# EasyEDA Pro project ProPrj_SX1262 125CM v0.5_2026-09-01.epro

# Schematic Schematic1
Board Name: Board1; Create Date: 2026-09-01; Page Name: P1; Project Name: SX1262 125CM v0.5; Schematic Name: Schematic1; Update Date: 2026-09-01; Company: EasyEDA.com; Page Size: A4; Version: V1.0
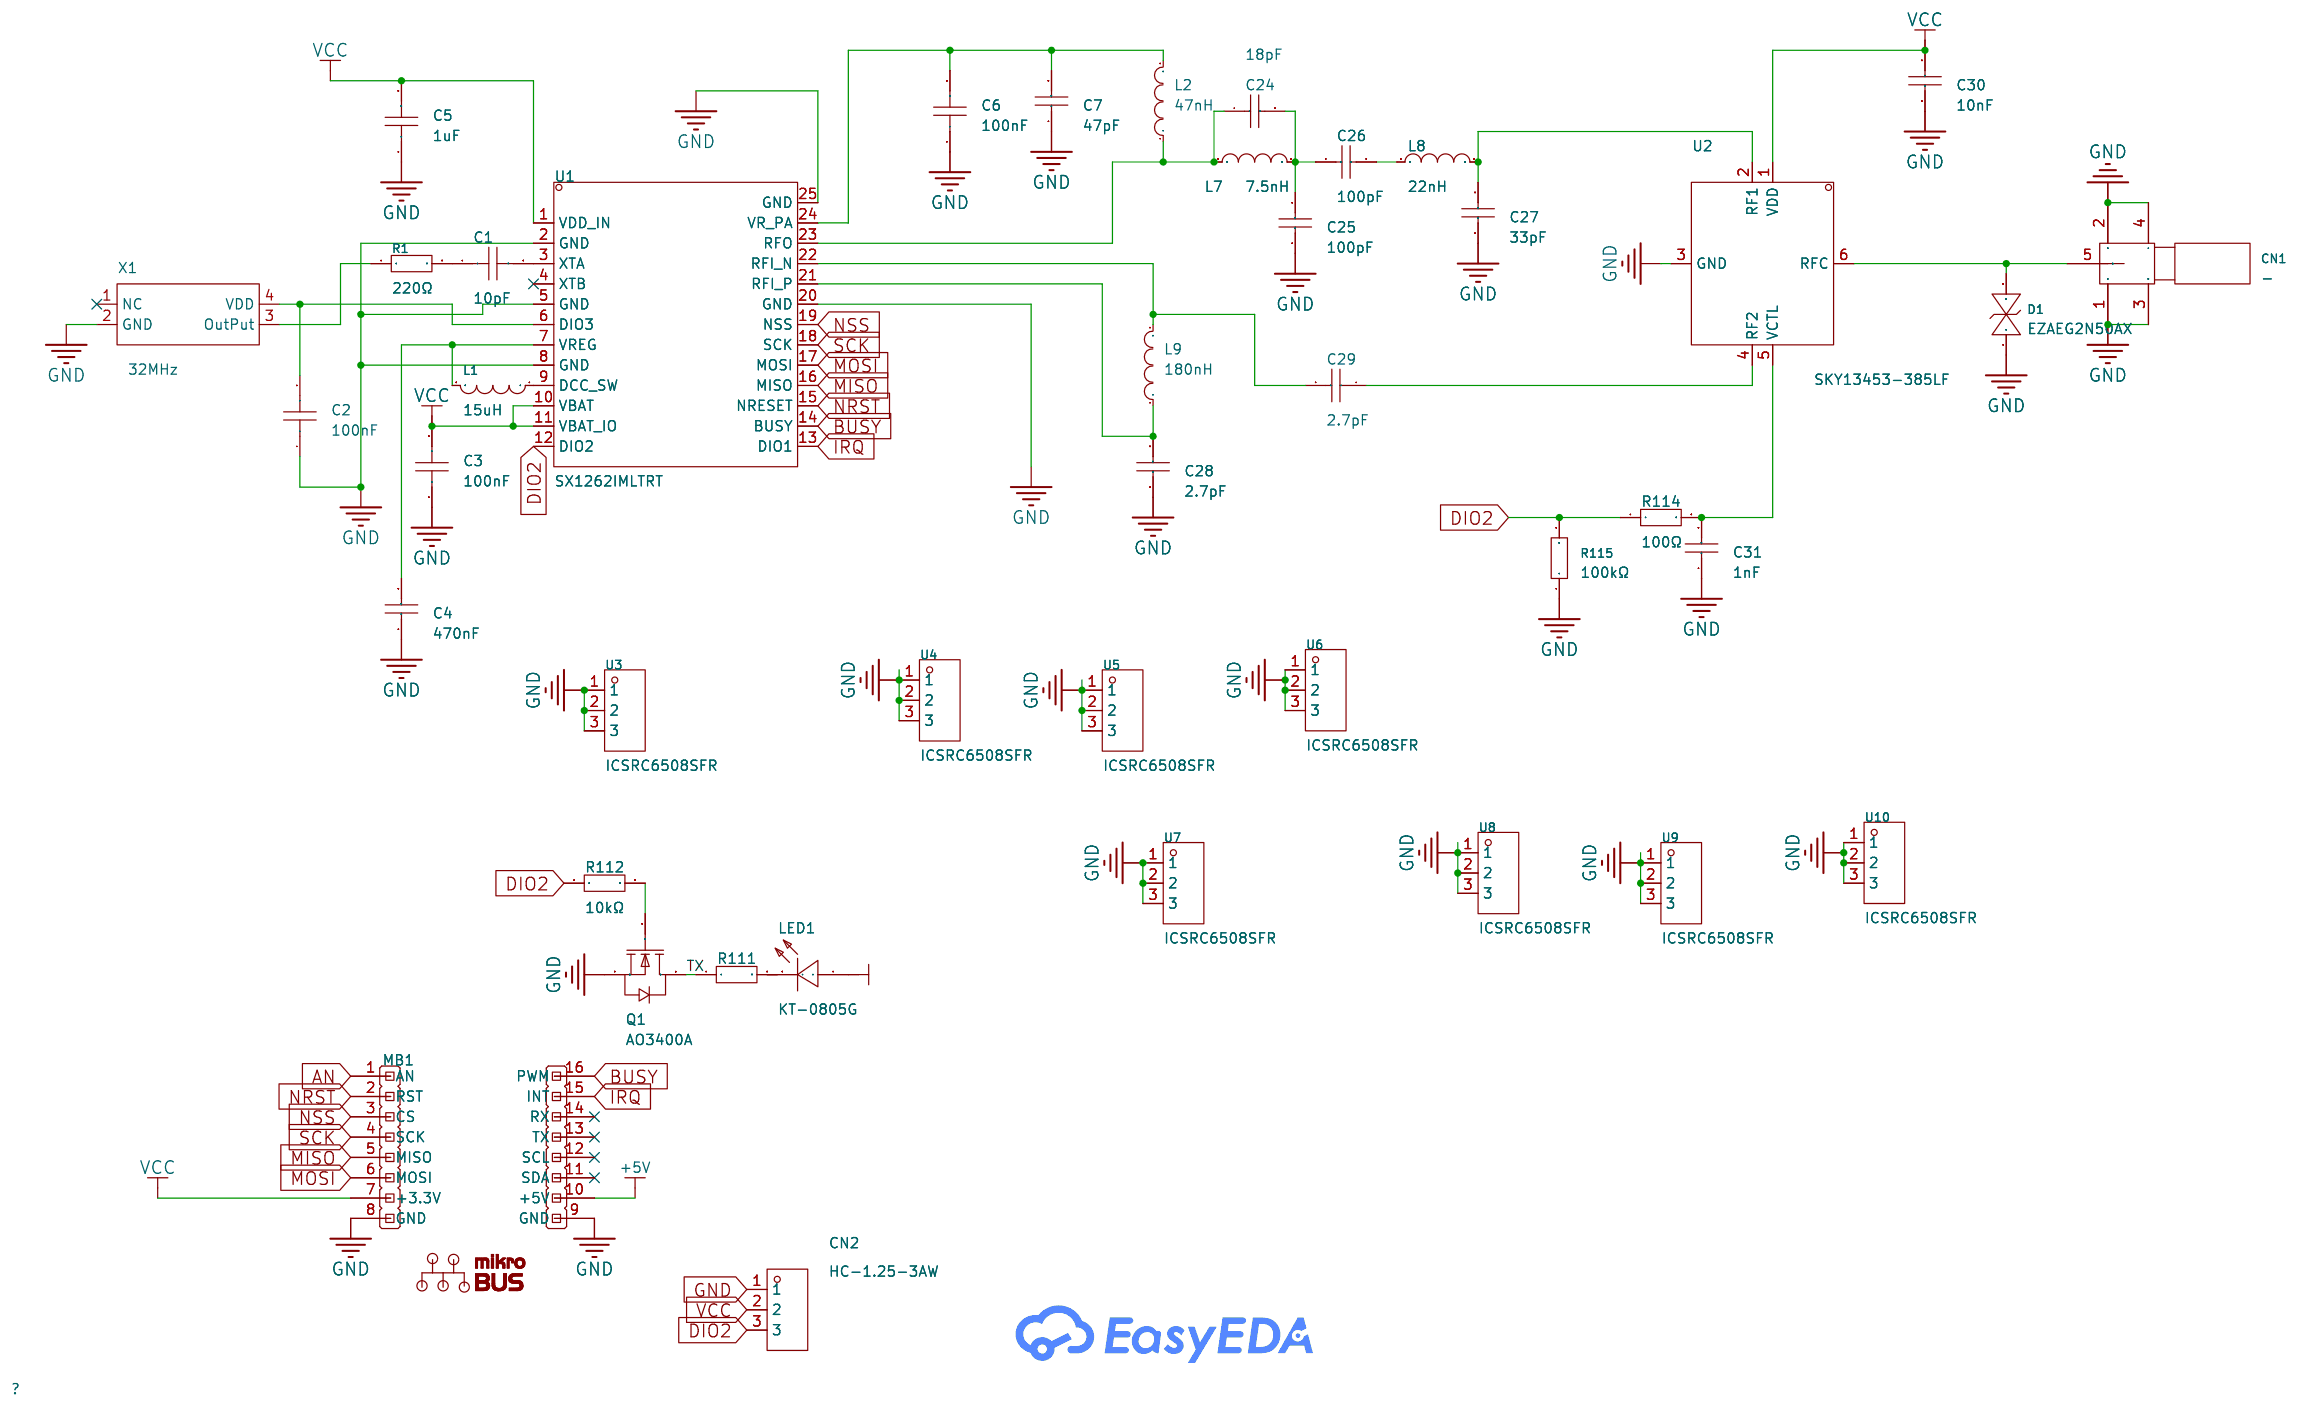
[diagram p0: schematic sheet]

## Parts
C1  10pF  [C0402]
C2  100nF  [C0402]
C3  100nF  [C0402]
C4  470nF  [C0603]
C5  1uF  [C0402]
C6  100nF  [C0402]
C7  47pF  [C0402]
C24  18pF  [C0402]
C25  100pF  [C0402]
C26  100pF  [C0402]
C27  33pF  [C0402]
C28  2.7pF  [C0402]
C29  2.7pF  [C0402]
C30  10nF  [C0402]
C31  1nF  [C0402]
CN1  -  [CONN-SMD_KH-SMA-KE8-G]
CN2  HC-1.25-3AW  [CONN-TH_3P-P1.25_HCTL_HC-1.25-3AW]
D1  EZAEG2N50AX  [D0402-BI]
L1  15uH  [L0805]
L2  47nH  [IND-SMD_L1.2-W0.6-1]
L7  7.5nH  [L0402]
L8  22nH  [L0402]
L9  180nH  [L0402-RD]
LED1  KT-0805G  [LED0805-R-RD]
MB1  -  [mikroBUS add-on Board]
Q1  AO3400A  [SOT-23-3_L2.9-W1.3-P1.90-LS2.4-BR]
R1  220Ω  [R0402]
R111  470Ω  [R0402]
R112  10kΩ  [R0402]
R114  100Ω  [R0402]
R115  100kΩ  [R0402]
U1  SX1262IMLTRT  [QFN-24_L4.0-W4.0-P0.50-BL-EP2.6]
U2  SKY13453-385LF  [QFN-6_L1.0-W1.0-P0.50-LS1.0-BL]
U3  ICSRC6508SFR  [SMD_3P-L6.7-W0.9-R3-P2.65-ICSRC6508SFR]
U4  ICSRC6508SFR  [SMD_3P-L6.7-W0.9-R3-P2.65-ICSRC6508SFR]
U5  ICSRC6508SFR  [SMD_3P-L6.7-W0.9-R3-P2.65-ICSRC6508SFR]
U6  ICSRC6508SFR  [SMD_3P-L6.7-W0.9-R3-P2.65-ICSRC6508SFR]
U7  ICSRC6508SFR  [SMD_3P-L6.7-W0.9-R3-P2.65-ICSRC6508SFR]
U8  ICSRC6508SFR  [SMD_3P-L6.7-W0.9-R3-P2.65-ICSRC6508SFR]
U9  ICSRC6508SFR  [SMD_3P-L6.7-W0.9-R3-P2.65-ICSRC6508SFR]
U10  ICSRC6508SFR  [SMD_3P-L6.7-W0.9-R3-P2.65-ICSRC6508SFR]
X1  32MHz  [OSC-SMD_4P-L2.0-W1.6-BL_1]

## Library data of the parts
C1 = CL05C100JB5NNNC: Capacitance:10pF Tolerance:±5% Tolerance:±5% Voltage Rating:50V Temperature Coefficient:C0G; LCSC Part Name: 10pF ±5% 50V; Supplier Part: C32949; Manufacturer: SAMSUNG(三星); Supplier Footprint: 0402; JLCPCB Part Class: Basic Part; Datasheet: https://item.szlcsc.com/datasheet/CL05C100JB5NNNC/33914.html; Supplier: LCSC; Tolerance: ±5%; Voltage Rating: 50V; Temperature Coefficient: C0G
C2 C3 C6 = CL05B104KO5NNNC: Capacitance:100nF Tolerance:±10% Tolerance:±10% Voltage Rating:16V Temperature Coefficient:X7R; LCSC Part Name: 100nF ±10% 16V; Supplier Part: C1525; Manufacturer: SAMSUNG(三星); Supplier Footprint: 0402; JLCPCB Part Class: Basic Part; Datasheet: https://item.szlcsc.com/datasheet/CL05B104KO5NNNC/1877.html; Supplier: LCSC; Tolerance: ±10%; Voltage Rating: 16V; Temperature Coefficient: X7R
C4 = CL10B474KA8NNNC: Capacitance:470nF Tolerance:±10% Tolerance:±10% Voltage Rating:25V Temperature Coefficient:X7R; LCSC Part Name: 470nF ±10% 25V; Supplier Part: C1623; Manufacturer: SAMSUNG(三星); Supplier Footprint: 0603; JLCPCB Part Class: Basic Part; Datasheet: https://item.szlcsc.com/datasheet/CL10B474KA8NNNC/1975.html; Supplier: LCSC; Tolerance: ±10%; Voltage Rating: 25V; Temperature Coefficient: X7R
C5 = CL05A105KA5NQNC: Capacitance:1uF Tolerance:±10% Tolerance:±10% Voltage Rating:25V Temperature Coefficient:X5R; LCSC Part Name: 1uF ±10% 25V; Supplier Part: C52923; Manufacturer: SAMSUNG(三星); Supplier Footprint: 0402; JLCPCB Part Class: Basic Part; Datasheet: https://item.szlcsc.com/datasheet/CL05A105KA5NQNC/53938.html; Supplier: LCSC; Tolerance: ±10%; Voltage Rating: 25V; Temperature Coefficient: X5R
C7 = 0402CG470J500NT: Capacitance:47pF Tolerance:±5% Tolerance:±5% Voltage Rating:50V Temperature Coefficient:C0G; LCSC Part Name: 47pF ±5% 50V; Supplier Part: C1567; Manufacturer: FH(风华); Supplier Footprint: 0402; JLCPCB Part Class: Basic Part; Datasheet: https://item.szlcsc.com/datasheet/0402CG470J500NT/1919.html; Supplier: LCSC; Tolerance: ±5%; Voltage Rating: 50V; Temperature Coefficient: C0G
C24 = 0402CG180J500NT: Capacitance:18pF Tolerance:±5% Tolerance:±5% Voltage Rating:50V Temperature Coefficient:C0G; LCSC Part Name: 18pF ±5% 50V; Supplier Part: C1549; Manufacturer: FH(风华); Supplier Footprint: 0402; JLCPCB Part Class: Basic Part; Datasheet: https://item.szlcsc.com/datasheet/0402CG180J500NT/1901.html; Supplier: LCSC; Tolerance: ±5%; Voltage Rating: 50V; Temperature Coefficient: C0G
C25 C26 = 0402CG101J500NT: Capacitance:100pF Tolerance:±5% Tolerance:±5% Voltage Rating:50V Temperature Coefficient:C0G; LCSC Part Name: 100pF ±5% 50V; Supplier Part: C1546; Manufacturer: FH(风华); Supplier Footprint: 0402; JLCPCB Part Class: Basic Part; Datasheet: https://item.szlcsc.com/datasheet/0402CG101J500NT/1898.html; Supplier: LCSC; Tolerance: ±5%; Voltage Rating: 50V; Temperature Coefficient: C0G
C27 = 0402CG330J500NT: Capacitance:33pF Tolerance:±5% Tolerance:±5% Voltage Rating:50V Temperature Coefficient:C0G; LCSC Part Name: 33pF ±5% 50V; Supplier Part: C1562; Manufacturer: FH(风华); Supplier Footprint: 0402; JLCPCB Part Class: Basic Part; Datasheet: https://item.szlcsc.com/datasheet/0402CG330J500NT/1914.html; Supplier: LCSC; Tolerance: ±5%; Voltage Rating: 50V; Temperature Coefficient: C0G
C28 C29 = 0402CG2R7C500NT: Capacitance:2.7pF Voltage Rating:50V Temperature Coefficient:C0G; LCSC Part Name: ±0.25pF 2.7pF 50V; Supplier Part: C1561; Manufacturer: FH(风华); Supplier Footprint: 0402; JLCPCB Part Class: Extended Part; Datasheet: https://item.szlcsc.com/datasheet/0402CG2R7C500NT/1913.html; Supplier: LCSC; Voltage Rating: 50V; Temperature Coefficient: C0G
C30 = CL05B103KB5NNNC: Capacitance:10nF Tolerance:±10% Tolerance:±10% Voltage Rating:50V Temperature Coefficient:X7R; LCSC Part Name: 10nF ±10% 50V; Supplier Part: C15195; Manufacturer: SAMSUNG(三星); Supplier Footprint: 0402; JLCPCB Part Class: Basic Part; Datasheet: https://item.szlcsc.com/datasheet/CL05B103KB5NNNC/15869.html; Supplier: LCSC; Tolerance: ±10%; Voltage Rating: 50V; Temperature Coefficient: X7R
C31 = 0402B102K500NT: Capacitance:1nF Tolerance:±10% Tolerance:±10% Voltage Rating:50V Temperature Coefficient:X7R; LCSC Part Name: 1nF ±10% 50V; Supplier Part: C1523; Manufacturer: FH(风华); Supplier Footprint: 0402; JLCPCB Part Class: Basic Part; Datasheet: https://item.szlcsc.com/datasheet/0402B102K500NT/1875.html; Supplier: LCSC; Tolerance: ±10%; Voltage Rating: 50V; Temperature Coefficient: X7R
CN1 = KH-SMA-KE8-G: Connector Type:Board Side Interface:Inner Bore Number of Ports:1 Interface Diameter:- Interface Length/Height:8mm Frequency:- RF Series:SMA Impedance:- Style:Offset Pin Operating Temperature Range:- Operating Temperature Range:-; LCSC Part Name: 内孔 SMA 偏脚; Supplier Part: C530661; Manufacturer: kinghelm(金航标); Supplier Footprint: 插件; JLCPCB Part Class: Extended Part; Datasheet: https://item.szlcsc.com/datasheet/KH-SMA-KE8-G/550995.html; Supplier: LCSC; Connector Type: Board Side; Interface: Inner Bore; Number of Ports: 1; Interface Length/Height: 8mm; RF Series: SMA; Style: Offset Pin
CN2 = HC-1.25-3AW: Pins Structure:1x3P Pitch:1.25mm Mounting Type:Right Angle Reference Series:PicoBlade(MX 1.25) Number of Pins:3P Number of Rows:1 Number of PINs Per Row:3 Row Spacing:- Current Rating:1A Contact Material:Brass Contact Plating:Tin Operating Temperature:-25; LCSC Part Name: 1x3P 间距:1.25mm 弯插 系列:PicoBlade(MX 1.25); Supplier Part: C2845536; Manufacturer: HCTL(华灿天禄); Supplier Footprint: 弯插,P=1.25mm; JLCPCB Part Class: Extended Part; Datasheet: https://item.szlcsc.com/datasheet/HC-1.25-3AW/3039217.html; Supplier: LCSC; Pins Structure: 1x3P; Pitch: 1.25mm; Mounting Type: Right Angle; Reference Series: PicoBlade(MX 1.25); Number of Pins: 3P; Number of Rows: 1; Number of PINs Per Row: 3; Current Rating: 1A; Contact Material: Brass; Contact Plating: Tin; Operating Temperature: -25℃~+85℃; Voltage Rating: 125V; Plastic Material: PA46; Flame Retardant Rating: UL94V-0; Z-Height of the Board: 3.2mm; X-Length of Bottom Edge on Board (Spacing Line): 5.5mm; Y-Width of Bottom Edge on Board: 4.7mm
D1 = EZAEG2N50AX: Reverse Stand-Off Voltage (Vrwm):30V Clamping Voltage:100V Reverse Leakage Current (Ir):1mA Operating Temperature:-55℃~+125℃ Operating Temperature:-55℃~+125℃ level of protection:IEC 61000-4-2 Type:ESD Junction Capacitance:0.05pF; Supplier Part: C543662; Manufacturer: PANASONIC(松下); Supplier Footprint: 0402; JLCPCB Part Class: Extended Part; Datasheet: https://item.szlcsc.com/datasheet/EZAEG2N50AX/564298.html; Supplier: LCSC; Reverse Stand-Off Voltage (Vrwm): 30V; Clamping Voltage: 100V; Reverse Leakage Current (Ir): 1mA; Operating Temperature: -55℃~+125℃; level of protection: IEC 61000-4-2; Type: ESD; Junction Capacitance: 0.05pF
L1 = MLZ2012M150WT000: Inductance:15uH Tolerance:±20% Tolerance:±20% Current Rating:- Current - Saturation (Isat):120mA DC Resistance(DCR):950mΩ Q @ Frequency:- Frequency - Self Resonant:2MHz Ratings:-; LCSC Part Name: 15uH ±20% 120mA; Supplier Part: C383402; Manufacturer: TDK; Supplier Footprint: 0805; JLCPCB Part Class: Extended Part; Datasheet: https://item.szlcsc.com/datasheet/MLZ2012M150WT000/356709.html; Supplier: LCSC; Tolerance: ±20%; Current - Saturation (Isat): 120mA; DC Resistance(DCR): 950mΩ; Frequency - Self Resonant: 2MHz
L2 = SCW1005C47NJST: Inductance:47nH Tolerance:±5% Tolerance:±5% Current Rating:200mA Current - Saturation (Isat):- DC Resistance(DCR):950mΩ Q @ Frequency:25@250MHz Frequency - Self Resonant:2.9GHz Ratings:- Type:Wire-wound chip inductor; LCSC Part Name: 47nH ±5%; Supplier Part: C330871; Manufacturer: Sunltech(顺磁); Supplier Footprint: 0402; JLCPCB Part Class: Extended Part; Datasheet: https://item.szlcsc.com/datasheet/SCW1005C47NJST/310273.html; Supplier: LCSC; Tolerance: ±5%; Current Rating: 200mA; DC Resistance(DCR): 950mΩ; Q @ Frequency: 25@250MHz; Frequency - Self Resonant: 2.9GHz; Type: Wire-wound chip inductor
L7 = LQG15HS7N5J02D: Inductance:7.5nH Tolerance:±5% Tolerance:±5% Current Rating:550mA Current - Saturation (Isat):- DC Resistance(DCR):240mΩ Q @ Frequency:8@100MHz Frequency - Self Resonant:4.2GHz Ratings:-; LCSC Part Name: 7.5nH ±5%; Supplier Part: C98001; Manufacturer: muRata(村田); Supplier Footprint: 0402; JLCPCB Part Class: Extended Part; Datasheet: https://item.szlcsc.com/datasheet/LQG15HS7N5J02D/99210.html; Supplier: LCSC; Tolerance: ±5%; Current Rating: 550mA; DC Resistance(DCR): 240mΩ; Q @ Frequency: 8@100MHz; Frequency - Self Resonant: 4.2GHz
L8 = SCW1005C22NJST: Inductance:22nH Tolerance:±5% Tolerance:±5% Current Rating:330mA Current - Saturation (Isat):- DC Resistance(DCR):360mΩ Q @ Frequency:25@250MHz Frequency - Self Resonant:4GHz Ratings:- Type:Wire-wound chip inductor; LCSC Part Name: 22nH ±5%; Supplier Part: C330861; Manufacturer: Sunltech(顺磁); Supplier Footprint: 0402; JLCPCB Part Class: Extended Part; Datasheet: https://item.szlcsc.com/datasheet/SCW1005C22NJST/310263.html; Supplier: LCSC; Tolerance: ±5%; Current Rating: 330mA; DC Resistance(DCR): 360mΩ; Q @ Frequency: 25@250MHz; Frequency - Self Resonant: 4GHz; Type: Wire-wound chip inductor
L9 = MLG1005SR18JTD25: Inductance: Tolerance:±5% Tolerance:±5% Rated Current: Saturation Current (Isat):- DC Resistance (DCR): Q @ Freq:8@100MHz Frequency - Self Resonant: Ratings:AEC-Q200; LCSC Part Name: 180nH ±5%; Supplier Part: C694570; Manufacturer: TDK; Supplier Footprint: 0402; JLCPCB Part Class: Extended Part; Datasheet: https://atta.szlcsc.com/upload/public/pdf/source/20210429/EF7AC43F62BD048FB58613B8084F8FDA.pdf; Supplier: LCSC; Tolerance: ±5%; Q @ Freq: 8@100MHz; Ratings: AEC-Q200
LED1 = KT-0805G: Lamp Holder Type:- Illumination Color:Emerald Green Voltage - Forward(Vf):2.6V~3.1V Voltage - Forward(Vf):2.6V~3.1V Power(Watts):100mW Forward Current:5mA Wavelength - Dominant:513nm~528nm Wavelength - Dominant:513nm~528nm Peak Wavelength:525nm Diode Conf; LCSC Part Name: 0805 翠绿 高亮; Supplier Part: C2297; Manufacturer: KENTO; Supplier Footprint: 0805; JLCPCB Part Class: Basic Part; Datasheet: https://item.szlcsc.com/datasheet/KT-0805G/2670.html; Supplier: LCSC; Illumination Color: Emerald Green; Voltage - Forward(Vf): 2.6V~3.1V; Power(Watts): 100mW; Forward Current: 5mA; Wavelength - Dominant: 513nm~528nm; Peak Wavelength: 525nm; Diode Configuration: Discrete Diode; Lens Color: Water Clear; Luminous Intensity: 430mcd; Viewing Angle: 120°; Operating Temperature: -40℃~+85℃
MB1 = mikroBUS: ClickBoard
Q1 = AO3400A_C20917: Number:- Drain to Source Voltage:30V Current - Continuous Drain(Id):- RDS(on):48mΩ@2.5V Pd - Power Dissipation:- Gate Threshold Voltage (Vgs(th)):1.45V@250uA Gate Charge(Qg):7nC@10V Input Capacitance(Ciss):630pF@15V Reverse Transfer Capacitance (Crss@Vds); LCSC Part Name: 1个N沟道 耐压:30V 电流:5.7A; Supplier Part: C20917; Manufacturer: AOS; Supplier Footprint: SOT-23-3L; JLCPCB Part Class: Basic Part; Datasheet: https://item.szlcsc.com/datasheet/AO3400A/21629.html; Supplier: LCSC; Drain to Source Voltage: 30V; RDS(on): 48mΩ@2.5V; Gate Threshold Voltage (Vgs(th)): 1.45V@250uA; Gate Charge(Qg): 7nC@10V; Input Capacitance(Ciss): 630pF@15V; Operating Temperature: -55℃~+150℃@(Tj); Type: N-Channel
R1 = 0402WGF2200TCE: Type:Thick Film Resistor Resistance:220Ω Tolerance:±1% Tolerance:±1% Power(Watts):62.5mW Voltage-Supply(Max):50V Temperature Coefficient:±100ppm/℃ Temperature Coefficient:±100ppm/℃ Operating Temperature:-55℃~+155℃ Operating Temperature:-55℃~+155℃; LCSC Part Name: 220Ω ±1% 62.5mW 厚膜电阻; Supplier Part: C25091; Manufacturer: UNI-ROYAL(厚声); Supplier Footprint: 0402; JLCPCB Part Class: Basic Part; Datasheet: https://item.szlcsc.com/datasheet/0402WGF2200TCE/25834.html; Supplier: LCSC; Type: Thick Film Resistor; Tolerance: ±1%; Power(Watts): 62.5mW; Voltage-Supply(Max): 50V; Temperature Coefficient: ±100ppm/℃; Operating Temperature: -55℃~+155℃
R111 = 0402WGF4700TCE: Type:Thick Film Resistor Resistance:470Ω Tolerance:±1% Tolerance:±1% Power(Watts):62.5mW Voltage-Supply(Max):50V Temperature Coefficient:±100ppm/℃ Temperature Coefficient:±100ppm/℃ Operating Temperature:-55℃~+155℃ Operating Temperature:-55℃~+155℃; LCSC Part Name: 470Ω ±1% 62.5mW 厚膜电阻; Supplier Part: C25117; Manufacturer: UNI-ROYAL(厚声); Supplier Footprint: 0402; JLCPCB Part Class: Basic Part; Datasheet: https://item.szlcsc.com/datasheet/0402WGF4700TCE/25860.html; Supplier: LCSC; Type: Thick Film Resistor; Tolerance: ±1%; Power(Watts): 62.5mW; Voltage-Supply(Max): 50V; Temperature Coefficient: ±100ppm/℃; Operating Temperature: -55℃~+155℃
R112 = 0402WGF1002TCE: Type:Thick Film Resistor Resistance:10kΩ Tolerance:±1% Tolerance:±1% Power(Watts):62.5mW Voltage-Supply(Max):50V Temperature Coefficient:±100ppm/℃ Temperature Coefficient:±100ppm/℃ Operating Temperature:-55℃~+155℃ Operating Temperature:-55℃~+155℃; LCSC Part Name: 10kΩ ±1% 62.5mW 厚膜电阻; Supplier Part: C25744; Manufacturer: UNI-ROYAL(厚声); Supplier Footprint: 0402; JLCPCB Part Class: Basic Part; Datasheet: https://item.szlcsc.com/datasheet/0402WGF1002TCE/26487.html; Supplier: LCSC; Type: Thick Film Resistor; Tolerance: ±1%; Power(Watts): 62.5mW; Voltage-Supply(Max): 50V; Temperature Coefficient: ±100ppm/℃; Operating Temperature: -55℃~+155℃
R114 = 0402WGF1000TCE: Type:Thick Film Resistors Resistance: Tolerance:±1% Tolerance:±1% Power(Watts): Overload Voltage (Max): Temperature Coefficient:±200ppm/℃ Temperature Coefficient:±200ppm/℃ Operating Temperature Range:-55℃~+155℃ Operating Temperature Range:-55℃~+155℃; LCSC Part Name: 100Ω ±1% 62.5mW 厚膜电阻; Supplier Part: C25076; Manufacturer: UNI-ROYAL(厚声); Supplier Footprint: 0402; JLCPCB Part Class: Basic Part; Datasheet: https://atta.szlcsc.com/upload/public/pdf/source/20200306/C422600_1E6D84923E4A46A82E41ADD87F860B5C.pdf; Supplier: LCSC; Type: Thick Film Resistors; Tolerance: ±1%; Temperature Coefficient: ±200ppm/℃; Operating Temperature Range: -55℃~+155℃
R115 = 0402WGF1003TCE: Type:Thick Film Resistor Resistance:100kΩ Tolerance:±1% Tolerance:±1% Power(Watts):62.5mW Voltage-Supply(Max):50V Temperature Coefficient:±100ppm/℃ Temperature Coefficient:±100ppm/℃ Operating Temperature:-55℃~+155℃ Operating Temperature:-55℃~+155℃; LCSC Part Name: 100kΩ ±1% 62.5mW 厚膜电阻; Supplier Part: C25741; Manufacturer: UNI-ROYAL(厚声); Supplier Footprint: 0402; JLCPCB Part Class: Basic Part; Datasheet: https://item.szlcsc.com/datasheet/0402WGF1003TCE/26484.html; Supplier: LCSC; Type: Thick Film Resistor; Tolerance: ±1%; Power(Watts): 62.5mW; Voltage-Supply(Max): 50V; Temperature Coefficient: ±100ppm/℃; Operating Temperature: -55℃~+155℃
U1 = SX1262IMLTRT: Frequency Range:- Frequency Range:- Interface:SPI Voltage - Supply:1.8V~3.7V Voltage - Supply:1.8V~3.7V Applications:General-purposeISM Output Power:22dBm Data Rate:300Kbps Current Of Transmitting:32mA Sensitivity:-148dBm Receive Current:4.2mA Operating T; Supplier Part: C191341; Manufacturer: SEMTECH; Supplier Footprint: QFN-24-EP(4x4); JLCPCB Part Class: Extended Part; Datasheet: https://item.szlcsc.com/datasheet/SX1262IMLTRT/216566.html; Supplier: LCSC; Interface: SPI; Voltage - Supply: 1.8V~3.7V; Applications: General-purposeISM; Output Power: 22dBm; Data Rate: 300Kbps; Current Of Transmitting: 32mA; Sensitivity: -148dBm; Receive Current: 4.2mA; Operating Temperature: -40℃~+85℃
U2 = SKY13453-385LF: Circuit:SPDT Frequency range:10MHz~6GHz Frequency range:10MHz~6GHz isolation:27dB Insertion loss:0.4dB P1dB:- Voltage - Supply:2.5V~3.5V Voltage - Supply:2.5V~3.5V operating temperature:-40℃~+90℃ operating temperature:-40℃~+90℃ Features:Integrated control; LCSC Part Name: 0.01至6.0GHz单控制SPDT射频开关; Supplier Part: C150878; Manufacturer: SKYWORKS; Supplier Footprint: QFN-6(1x1); JLCPCB Part Class: Extended Part; Datasheet: https://item.szlcsc.com/datasheet/SKY13453-385LF/162218.html; Supplier: LCSC; Circuit: SPDT; Frequency range: 10MHz~6GHz; isolation: 27dB; Insertion loss: 0.4dB; Voltage - Supply: 2.5V~3.5V; operating temperature: -40℃~+90℃; Features: Integrated control logic
U3-U10 = ICSRC6508SFR: size:6.5mm*1.21mm colour:White length:-; LCSC Part Name: ICT，屏蔽夹 ，长6.5mm*高1.21mm，ICSRC6508SFR; Supplier Part: C238199; Manufacturer: ICT; JLCPCB Part Class: Extended Part; Datasheet: https://item.szlcsc.com/datasheet/ICSRC6508SFR/237760.html; Supplier: LCSC; size: 6.5mm*1.21mm; colour: White
X1 = OW7EL89CANUXK7YLC-32M: Frequency:32MHz Frequency Stability:±500ppb Frequency Stability:±500ppb Output Type:Clipped sine wave Voltage - Supply:1.8V Voltage - Supply:1.8V Current - Supply:- Operating Temperature:-30℃~+85℃ Operating Temperature:-30℃~+85℃ Ratings:-; LCSC Part Name: YSO510TP 32MHZ 1.8V ±1.5PPM -30~85℃ (±0.5PPM) Clipped Sine Wave; Supplier Part: C48332759; Manufacturer: YXC(扬兴晶振); Supplier Footprint: SMD2016-4P; JLCPCB Part Class: Extended Part; Datasheet: https://item.szlcsc.com/datasheet/OW7EL89CANUXK7YLC-32M/50580117.html; Supplier: LCSC; Frequency Stability: ±500ppb; Output Type: Clipped sine wave; Voltage - Supply: 1.8V; Operating Temperature: -30℃~+85℃

## Nets
+5V: MB1.10(+5V)
GND: C2.1 C3.1 C4.1 C5.1 C6.1 C7.1 C25.1 C27.1 C28.1 C30.1 C31.1 CN1.1 CN1.2 CN1.3 CN1.4 CN2.1 D1.1 MB1.8(GND) MB1.9(GND) Q1.2(S) R115.1 U1.2(GND) U1.5(GND) U1.8(GND) U1.20(GND) U1.25(GND) U2.3(GND) U3.1 U3.2 U3.3 U4.1 U4.2 U4.3 U5.1 U5.2 U5.3 U6.1 U6.2 U6.3 U7.1 U7.2 U7.3 U8.1 U8.2 U8.3 U9.1 U9.2 U9.3 U10.1 U10.2 U10.3 X1.2(GND)
VCC: C3.2 C5.2 C30.2 CN2.2 LED1.1(A) MB1.7(+3.3V) U1.1(VDD_IN) U1.10(VBAT) U1.11(VBAT_IO) U2.1(VDD)
AN: MB1.1(AN)
BUSY: MB1.16(PWM) U1.14(BUSY)
DIO2: CN2.3 R112.1 R114.1 R115.2 U1.12(DIO2)
IRQ: MB1.15(INT) U1.13(DIO1)
MISO: MB1.5(MISO) U1.16(MISO)
MOSI: MB1.6(MOSI) U1.17(MOSI)
NRST: MB1.2(RST) U1.15(NRESET)
NSS: MB1.3(CS) U1.19(NSS)
SCK: MB1.4(SCK) U1.18(SCK)
TX: Q1.3(D) R111.1
$1N896: C1.2 U1.3(XTA)
$1N969: C1.1 R1.2
$1N1011: C2.2 U1.6(DIO3) X1.4(VDD)
$1N1017: R1.1 X1.3(OutPut)
$1N1388: C4.2 L1.2 U1.7(VREG)
$1N1396: L1.1 U1.9(DCC_SW)
$1N1923: C6.2 C7.2 L2.2 U1.24(VR_PA)
$1N2924: C29.2 L9.2 U1.22(RFI_N)
$1N3047: C28.2 L9.1 U1.21(RFI_P)
$1N4328: LED1.2(K) R111.2
$1N4330: Q1.1(G) R112.2
$1N8839: C24.1 L2.1 L7.1 U1.23(RFO)
$1N12166: C24.2 C25.2 C26.1 L7.2
$1N12308: C26.2 L8.1
$1N12515: CN1.5 D1.2 U2.6(RFC)
$1N13592: C31.2 R114.2 U2.5(VCTL)
$1N13617: C27.2 L8.2 U2.2(RF1)
$1N13621: C29.1 U2.4(RF2)

Not connected (* = marked no-connect by the designer): MB1 11(SDA)* 12(SCL)* 13(TX)* 14(RX)*; U1 4(XTB)*; X1 1(NC)*

# Board PCB1
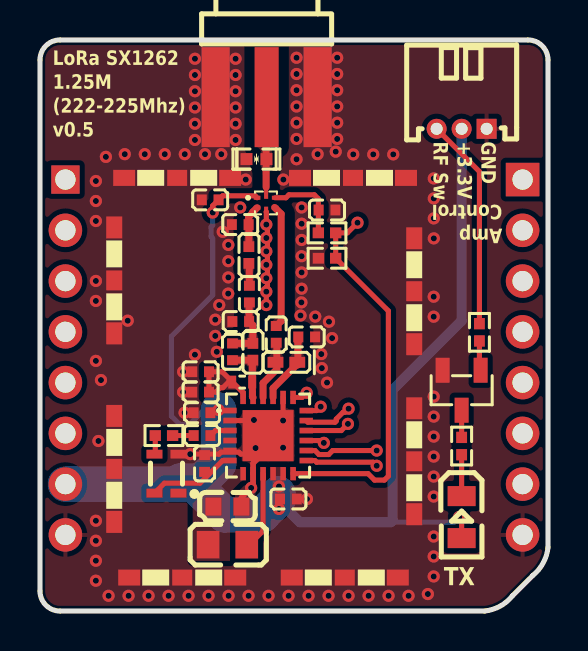
[diagram p1: board, top side]
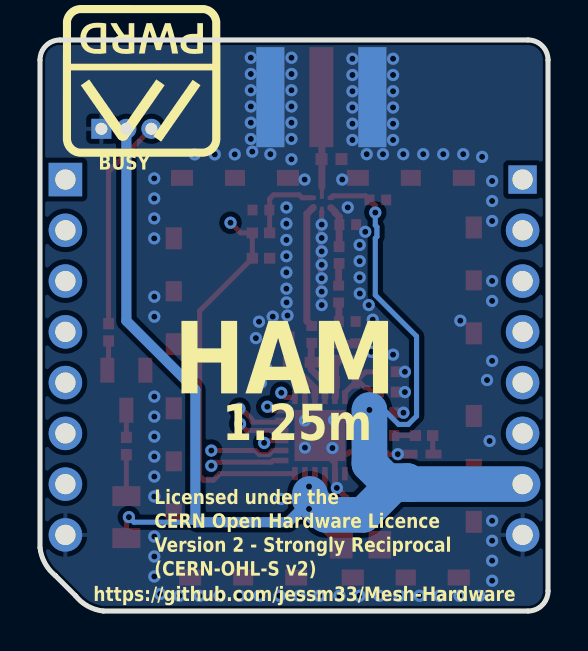
[diagram p2: board, bottom side, seen from below]

Outline 25.4 x 28.58 mm; copper layers: Top Layer, Inner1, Inner2, Bottom Layer. Coordinates in mm from the lower left corner of the outline.
Outline path: 0,27.58 arc(0.29,28.28) 1,28.58 24.4,28.58 arc(25.11,28.28) 25.4,27.58 25.4,3.18 arc(25.16,2.4) 24.64,1.78 23.62,0.76 arc(23.01,0.24) 22.24,0 1,0 arc(0.29,0.29) 0,1 0,27.58
Stack: Top Layer 0.035mm Outer layer thickness 1oz / Dielectric1 0.2104mm 7628 RC49% 8.6mil / Inner1 0.0152mm Inner layer thickness / Dielectric2 1.065mm 1.1mm H/HOZ Copper / Inner2 0.0152mm Inner layer thickness / Dielectric3 0.2104mm 7628 RC49% 8.6mil / Bottom Layer 0.035mm Outer layer thickness 1oz

## Design rules (mm)
net $1N3047: RF
net $1N2924: RF
net $1N8839: RF
net $1N13617: RF
net $1N12308: RF
net $1N12166: RF
net $1N12515: RF
net $1N13621: RF
template: Custom Config
spacing copperThickness1oz (default): track to track 0.102, other pairs 0.152 to 0.3
spacing copperThickness2oz: track to track 0.203, other pairs 0.152 to 0.3
spacing safeClearance1: track to track 0.152, other pairs 0.152 to 0.508
track width copperThickness1oz (default): min 0.127, default 0.254, max 2.54
track width copperThickness2oz: min 0.203, default 0.254, max 2.54
differential pair differentialPair (default): width min 0.127, default 0.254, max 2.54; gap min 0.152, default 0.152
via viaSize (default): diameter min 0.5, default 0.61, max 10; hole min 0.3, default 0.305, max 6.3
net class RF uses copperRegion1
net $1N3047 uses copperRegion1
net $1N2924 uses copperRegion1
net $1N8839 uses copperRegion1
net $1N13617 uses copperRegion1
net $1N12308 uses copperRegion1
net $1N12166 uses copperRegion1
net $1N12515 uses copperRegion1
net $1N13621 uses copperRegion1

## Placement (name value [footprint] x y rotation side)
C1  10pF  [C0402]  8.1 8.78 0 top
C2  100nF  [C0402]  8.23 7.38 270 top
C3  100nF  [C0402]  12.42 5.61 180 top
C4  470nF  [C0603]  9.37 5.22 180 top
C5  1uF  [C0402]  8.1 9.92 0 top
C6  100nF  [C0402]  8.03 11.97 0 top
C7  47pF  [C0402]  8.03 10.96 0 top
C24  18pF  [C0402]  9.63 12.97 90 top
C25  100pF  [C0402]  10.04 14.49 0 top
C26  100pF  [C0402]  10.47 15.86 90 top
C27  33pF  [C0402]  10.01 19.34 0 top
C28  2.7pF  [C0402]  13.34 13.72 180 top
C29  2.7pF  [C0402]  11.81 13.84 270 top
C30  10nF  [C0402]  8.51 20.57 0 top
C31  1nF  [C0402]  14.35 20.07 180 top
CN1  -  [CONN-SMD_KH-SMA-KE8-G]  11.33 25.71 0 top
CN2  HC-1.25-3AW  [CONN-TH_3P-P1.25_HCTL_HC-1.25-3AW]  21.08 24.13 180 top
D1  EZAEG2N50AX  [D0402-BI]  10.82 22.61 0 top
L1  15uH  [L0805]  9.37 3.32 180 top
L2  47nH  [IND-SMD_L1.2-W0.6-1]  10.11 11.46 180 top
L7  7.5nH  [L0402]  10.64 12.97 90 top
L8  22nH  [L0402]  10.44 17.81 90 top
L9  180nH  [L0402-RD]  12.32 12.45 180 top
LED1  KT-0805G  [LED0805-R-RD]  21.08 4.7 270 top
MB1  -  [mikroBUS add-on Board]  12.7 12.7 0 top
Q1  AO3400A  [SOT-23-3_L2.9-W1.3-P1.90-LS2.4-BR]  21.08 11.05 90 top
R1  220Ω  [R0402]  6.2 8.78 0 top
R111  470Ω  [R0402]  21.08 8.26 270 top
R112  10kΩ  [R0402]  21.97 13.95 270 top
R114  100Ω  [R0402]  14.35 18.92 180 top
R115  100kΩ  [R0402]  14.35 17.65 0 top
U1  SX1262IMLTRT  [QFN-24_L4.0-W4.0-P0.50-BL-EP2.6]  11.4 8.78 270 top
U2  SKY13453-385LF  [QFN-6_L1.0-W1.0-P0.50-LS1.0-BL]  11.31 20.43 270 top
U3  ICSRC6508SFR  [SMD_3P-L6.7-W0.9-R3-P2.65-ICSRC6508SFR]  18.71 7.49 90 top
U4  ICSRC6508SFR  [SMD_3P-L6.7-W0.9-R3-P2.65-ICSRC6508SFR]  3.71 16.54 90 top
U5  ICSRC6508SFR  [SMD_3P-L6.7-W0.9-R3-P2.65-ICSRC6508SFR]  15.24 1.68 0 top
U6  ICSRC6508SFR  [SMD_3P-L6.7-W0.9-R3-P2.65-ICSRC6508SFR]  15.65 21.67 0 top
U7  ICSRC6508SFR  [SMD_3P-L6.7-W0.9-R3-P2.65-ICSRC6508SFR]  7.11 1.68 0 top
U8  ICSRC6508SFR  [SMD_3P-L6.7-W0.9-R3-P2.65-ICSRC6508SFR]  3.71 7.11 90 top
U9  ICSRC6508SFR  [SMD_3P-L6.7-W0.9-R3-P2.65-ICSRC6508SFR]  18.71 16 90 top
U10  ICSRC6508SFR  [SMD_3P-L6.7-W0.9-R3-P2.65-ICSRC6508SFR]  6.86 21.67 0 top
X1  32MHz  [OSC-SMD_4P-L2.0-W1.6-BL_1]  6.32 6.88 90 top

## Footprints (pads in the part's own frame, mm; a bottom-side part is the same pattern mirrored in y, then rotated)
C0402
  rect 0.5x0.54 smd: 1(-0.42,0) 2(0.42,0)
C0603
  rect 0.8x0.9 smd: 1(-0.7,0) 2(0.7,0)
CONN-SMD_KH-SMA-KE8-G
  rect 1.4x5 smd: 1(-2.55,0) 2(2.55,0)
  rect 1.4x5 smd far side: 3(-2.55,0) 4(2.55,0)
  rect 1.2x5 smd: 5(0,0)
CONN-TH_3P-P1.25_HCTL_HC-1.25-3AW
  rect 1x1 hole 0.6: 1(-1.25,0)
  round 1 hole 0.6: 2(0,0) 3(1.25,0)
D0402-BI
  rect 0.6x0.6 smd: 1(-0.5,0) 2(0.5,0)
IND-SMD_L1.2-W0.6-1
  rect 0.4x0.64 smd: 1(-0.5,0) 2(0.5,0)
L0402
  rect 0.54x0.54 smd: 1(-0.42,0) 2(0.42,0)
L0402-RD
  rect 0.79x0.54 smd: 1(-0.545,0) 2(0.545,0)
L0805
  rect 1.133x1.377 smd: 1(-0.966,0) 2(0.966,0)
LED0805-R-RD
  rect 1x1.399 smd: 1(1.05,0) 2(-1.05,0)
mikroBUS add-on Board
  rect 1.415x1.415 hole 1.016: 1(-11.429,8.89)
  round 1.677 hole 1.016: 2(-11.43,6.35) 3(-11.43,3.81) 4(-11.43,1.27) 5(-11.43,-1.27) 6(-11.43,-3.81) 7(-11.43,-6.35) 8(-11.43,-8.89) 9(11.43,-8.89) 10(11.43,-6.35) 11(11.43,-3.81) 12(11.43,-1.27) 13(11.43,1.27) 14(11.43,3.81) 15(11.43,6.35)
  rect 1.677x1.677 hole 1.016: 16(11.43,8.89)
OSC-SMD_4P-L2.0-W1.6-BL_1
  rect 0.44x0.8 smd: 1(-0.975,-0.6) 2(0.975,-0.6) 3(0.975,0.6) 4(-0.975,0.6)
QFN-6_L1.0-W1.0-P0.50-LS1.0-BL
  rect 0.2x0.33 smd: 1(-0.25,-0.453) 2(0.25,-0.453) 4(0.25,0.453) 5(-0.25,0.453)
  rect 0.51x0.2 smd: 3(0.453,0) 6(-0.453,0)
QFN-24_L4.0-W4.0-P0.50-BL-EP2.6
  rect 0.28x0.665 smd: 1(-1.25,-1.907) 2(-0.75,-1.907) 3(-0.25,-1.907) 4(0.25,-1.907) 5(0.75,-1.907) 6(1.25,-1.907) 13(1.25,1.907) 14(0.75,1.907) 15(0.25,1.907) 16(-0.25,1.907) 17(-0.75,1.907) 18(-1.25,1.907)
  rect 0.665x0.28 smd: 7(1.907,-1.25) 8(1.907,-0.75) 9(1.907,-0.25) 10(1.907,0.25) 11(1.907,0.75) 12(1.907,1.25) 19(-1.907,1.25) 20(-1.907,0.75) 21(-1.907,0.25) 22(-1.907,-0.25) 23(-1.907,-0.75) 24(-1.907,-1.25)
  rect 2.55x2.55 smd: 25(0,0)
R0402
  rect 0.566x0.54 smd: 1(-0.433,0) 2(0.433,0)
SMD_3P-L6.7-W0.9-R3-P2.65-ICSRC6508SFR
  rect 1.1x0.8 smd: 1(-2.65,0) 3(2.65,0)
  rect 1x0.8 smd: 2(0,0)
SOT-23-3_L2.9-W1.3-P1.90-LS2.4-BR
  rect 1.25x0.7 smd: 1(1,-0.95) 2(1,0.95) 3(-1,0)

## Nets
As in the schematic.

Pads without a net: MB1 11 12 13 14; U1 4; X1 1

## Via types
v1: diameter 0.61, hole 0.305, Top Layer to Bottom Layer, 139 vias

## Routing (per net, layer and track width the routed paths; a pad name or vN(x,y) marks a point on that pad's centre or on a via; arc(x,y) is an arc through that point)
GND: length 16.4
  Top Layer w0.254: U2.3 11.32,19.97 v1(11.32,19.34) 11.32,19.22 11.37,19.17 11.37,16.27 11.32,16.21 11.32,15.51 ; U1.2 10.67,9.53 v1(10.7,9.56) ; X1.2 v1(7.51,7.85) 8.95,7.85 9.05,7.95 9.94,7.95 10.04,7.85 10.47,7.85 v1(10.78,8.16) U1.25 v1(12.15,9.53) U1.20
  Top Layer w0.28: C4.1 10.07,5.67 v1(10.56,6.16) 10.56,6.32 10.65,6.42 U1.8 10.65,7.4 11.4,8.15
  vias: v1(2.79,21.52) v1(2.79,20.52) v1(2.79,19.52) v1(2.79,16.52) v1(2.79,15.52) v1(2.79,12.52) v1(2.79,4.52) v1(2.79,3.52) v1(2.79,2.52) v1(2.79,1.52) v1(2.92,8.51) v1(3.05,11.56) v1(3.29,22.73) v1(3.43,0.76) v1(4.24,22.86) v1(4.39,14.53) v1(4.43,0.76) v1(5.24,22.86) v1(5.43,0.76) v1(6.24,22.86) v1(6.43,0.76) v1(7.24,22.86) v1(7.16,11.97) v1(7.16,10.96) v1(7.23,9.92) v1(7.43,0.76) v1(7.75,27.64) v1(7.75,26.82) v1(7.75,26.01) v1(7.75,25.2) v1(7.75,24.38) v1(7.75,23.57) v1(7.75,12.83) v1(8.25,22.86) v1(8.43,0.76) v1(8.76,14.58) v1(8.76,13.77) v1(8.84,12.97) v1(8.96,15.31) v1(9.06,22.86) v1(9.14,18.98) v1(9.42,18.32) v1(9.42,17.51) v1(9.42,16.69) v1(9.41,15.88) v1(9.43,0.76) v1(9.78,27.64) v1(9.78,26.82) v1(9.78,26.01) v1(9.78,25.2) v1(9.78,24.38) v1(9.78,23.57) v1(10.01,20.19) v1(10.29,21.59) v1(10.43,0.76) v1(11.32,18.67) v1(11.32,18) v1(11.32,17.32) v1(11.32,16.65) v1(11.32,15.98) v1(11.32,15.31) v1(11.43,0.76) v1(12.17,21.59) v1(12.15,8.18) v1(12.43,0.76) v1(12.83,27.69) v1(12.83,26.87) v1(12.83,26.06) v1(12.83,25.25) v1(12.83,24.44) v1(12.83,23.62) v1(12.83,22.61) v1(13.03,14.79) v1(13.08,20.19) v1(13.08,19.38) v1(13.08,18.57) v1(13.08,17.75) v1(13.08,16.94) v1(13.08,16.13) v1(13.07,15.44) v1(13.35,5.61) v1(13.43,0.76) v1(13.76,14.73) v1(13.88,22.86) v1(14.06,12.86) v1(14.09,12.16) v1(14.45,14.48) v1(14.35,11.43) v1(14.43,0.76) v1(14.6,13.66) v1(14.79,22.99) v1(14.86,27.69) v1(14.86,26.87) v1(14.86,26.06) v1(14.86,25.25) v1(14.86,24.44) v1(14.86,23.62) v1(15.43,0.76) v1(15.66,22.85) v1(16.43,0.76) v1(16.66,22.85) v1(17.43,0.76) v1(17.66,22.85) v1(18.43,0.76) v1(19.39,0.85) v1(19.69,21.65) v1(19.69,20.65) v1(19.69,19.65) v1(19.69,18.65) v1(19.69,15.73) v1(19.69,14.73) v1(19.69,10.73) v1(19.69,9.73) v1(19.69,8.73) v1(19.69,7.73) v1(19.69,6.73) v1(19.69,5.73) v1(19.69,3.73) v1(19.69,2.73) v1(19.69,1.73)
VCC: length 66.2
  Top Layer w0.254: v1(20.96,4.7) 21.08,4.57 LED1.1 ; U2.1 10.76,20.78 9.13,20.78 8.64,20.28 v1(8.64,19.94)
  Bottom Layer w0.254: 18.65,4.45 17.54,4.45 ; v1(8.64,19.94) 8.64,19.3 8.55,19.22 8.55,18.73 8.64,18.65 8.64,15.81 6.57,13.75 6.57,9.75 6.99,9.34 7.47,9.34 8.25,10.12 8.93,10.12 9.27,9.78 ; 18.65,4.46 18.67,4.45 20.7,4.45 v1(20.96,4.7)
  Bottom Layer w0.508: 11.87,5.57 12.99,4.45 17.54,4.45 17.63,4.54 17.63,11.07 21.08,14.52 CN2.2
  Bottom Layer w1.778: v1(8.93,10.06) 8.93,7.36 8.07,6.5 7.03,6.5 6.88,6.35 ; 11.9,5.86 11.9,5.6 11.12,4.81 9.24,4.81 7.7,6.35 6.88,6.35 ; 6.88,6.35 MB1.7
  vias: v1(11.95,6.23) v1(11.95,5.11)
BUSY: length 20.3
  Top Layer w0.254: v1(16.83,8.03) 14.63,8.03 14.43,7.83 13.95,7.83 13.75,8.03 U1.14
  Inner2 w0.254: MB1.16 17.06,14.52 17.06,8.26 v1(16.83,8.03)
DIO2: length 36.5
  Top Layer w0.254: v1(15.88,19.43) 15.37,18.92 R114.1 R115.2 17.42,15.02 17.42,6.75 17.22,6.55 16.73,6.55 16.4,6.87 U1.12 ; CN2.3 21.97,21.99 R112.1
  Inner2 w0.254: CN2.3 19.83,23.39 v1(15.88,19.43)
IRQ: length 19.7
  Top Layer w0.254: U1.13 13.75,7.53 13.83,7.45 16.66,7.45 v1(16.83,7.27)
  Inner2 w0.254: v1(16.83,7.27) 16.9,7.27 17.42,7.79 17.42,14.37 22.09,19.05 MB1.15
MISO: length 27.2
  Top Layer w0.254: U1.16 15.06,9.03 v1(15.4,9.36)
  Inner2 w0.254: v1(15.4,9.36) 15.4,9.04 15.89,8.55 15.89,5.73 13.62,3.45 5.45,3.45 4.39,4.51 4.39,8.31 MB1.5
MOSI: length 26.8
  Top Layer w0.254: v1(15.43,10.13) 15.25,9.95 15.16,9.95 14.81,9.61 14.81,9.51 14.75,9.45 13.39,9.45 U1.17
  Inner2 w0.254: v1(15.43,10.13) 15.61,9.95 15.64,9.95 16.25,9.34 16.25,5.58 13.77,3.1 5.3,3.1 4.04,4.36 4.04,6.12 MB1.6
NRST: length 29.7
  Top Layer w0.254: U1.15 14.07,8.53 v1(14.19,8.41)
  Inner2 w0.254: MB1.2 1.91,19.05 5.59,15.37 5.59,5.08 6.15,4.52 13.18,4.52 14.83,6.17 14.83,7.78 v1(14.19,8.41)
NSS: length 30.7
  Top Layer w0.254: v1(13.34,10.92) 13.1,10.69 U1.19
  Inner2 w0.254: v1(13.34,10.92) 13.34,10.1 15.18,8.25 15.18,6.02 13.32,4.17 6,4.17 5.23,4.93 5.23,11.59 1.27,15.55 MB1.3
SCK: length 29
  Top Layer w0.254: U1.18 13.84,10.03 v1(14.03,10.22)
  Inner2 w0.254: v1(14.03,10.22) 14.03,9.9 15.54,8.4 15.54,5.88 13.47,3.81 5.85,3.81 4.88,4.79 4.88,11.44 2.35,13.97 MB1.4
TX: length 1.4
  Top Layer w0.254: Q1.3 R111.1
$1N896: length 1.1
  Top Layer w0.254: U1.3 8.77,9.03 C1.2
$1N969: length 1.1
  Top Layer w0.254: C1.1 R1.2
$1N1011: length 4.4
  Top Layer w0.254: X1.4 6.22,6.4 8,6.4 9.13,7.53 U1.6
$1N1017: length 0.9
  Top Layer w0.254: R1.1 5.76,7.89
$1N1396: length 4
  Top Layer w0.254: 10.34,3.19 11.15,4.01 U1.9
$1N1923: length 4.8
  Top Layer w0.254: 9.63,11.45 9.11,11.97 C6.2 C7.2 8.8,10.96 9.02,11.18 9.14,11.18 9.42,11.45 9.63,11.45 ; 9.63,11.45 10.15,10.93 U1.24
$1N2924: length 3
  Top Layer w0.348: C29.2 11.84,13.39 11.84,12.09 11.15,11.41 U1.22
$1N3047: length 3.6
  Top Layer w0.348: C28.2 12.91,13.48 12.89,13.46 12.89,12.32 12.83,12.32 11.65,11.15 U1.21
$1N4328: length 2.1
  Top Layer w0.254: R111.2 LED1.2
$1N4330: length 1.5
  Top Layer w0.254: Q1.1 21.97,12.11 R112.2
$1N8839: length 2.9
  Top Layer w0.348: U1.23 10.62,10.72 10.62,12.53 L7.1 C24.1
$1N12166: length 3.1
  Top Layer w0.348: L7.2 10.64,14.3 C25.2 10.46,15.43 C26.1 ; 9.63,13.39 10.64,13.39
$1N12308: length 1.1
  Top Layer w0.348: C26.2 10.47,17.37 L8.1
$1N12515: length 4.5
  Top Layer w0.348: CN1.5 11.31,25.69 11.31,21.21
$1N13592: length 4
  Top Layer w0.254: U2.5 12.3,20.68 12.45,20.83 13.72,20.83 13.92,20.63 R114.2
$1N13617: length 2.1
  Top Layer w0.348: L8.2 10.44,19.33 C27.2 10.43,19.72 10.64,19.93 10.64,19.97 U2.2
$1N13621: length 6.2
  Top Layer w0.348: 11.73,20.19 12.06,19.87 12.06,14.51 C29.1

## Copper pours and planes (outline as drawn; the poured copper is in the pictures)
GND on Top Layer: -4.06,32.51 30.73,32.51 30.73,-11.18 -4.06,-11.18
GND on Bottom Layer: -3.56,33.15 29.59,33.15 29.59,-8.89 -3.56,-8.89
GND on Inner1: 0.26,28.32 25.14,28.32 25.14,0.26 0.26,0.26
GND on Inner2: -2.67,30.48 33.15,30.48 33.15,-6.1 -2.67,-6.1
VCC on Top Layer: 11.62,7.21 12.22,7.21 12.22,5.26 11.62,5.26
$1N1388 on Top Layer: 7.63,7.1 10.15,7.1 10.15,2.51 7.63,2.51
$1N1923 on Top Layer: 8.28,12.2 9.89,12.2 9.89,10.71 8.28,10.71

Small or netless copper shapes (teardrops, artwork), in the pictures only: 23 on Top Layer, 9 on Inner1

## Text on the board
Bottom Silkscreen Layer: BUSY | Licensed under the / CERN Open Hardware Licence / Version 2 - Strongly Reciprocal / (CERN-OHL-S v2) | https://github.com/jessm33/Mesh-Hardware | 1.25m | HAM
Top Silkscreen Layer: LoRa SX1262 / 1.25M / (222-225Mhz) / v0.5 | GND / +3.3V / RF Sw | Amp / Control | TX
